# EAGLE board M869D (EAGLE 6.6.0)
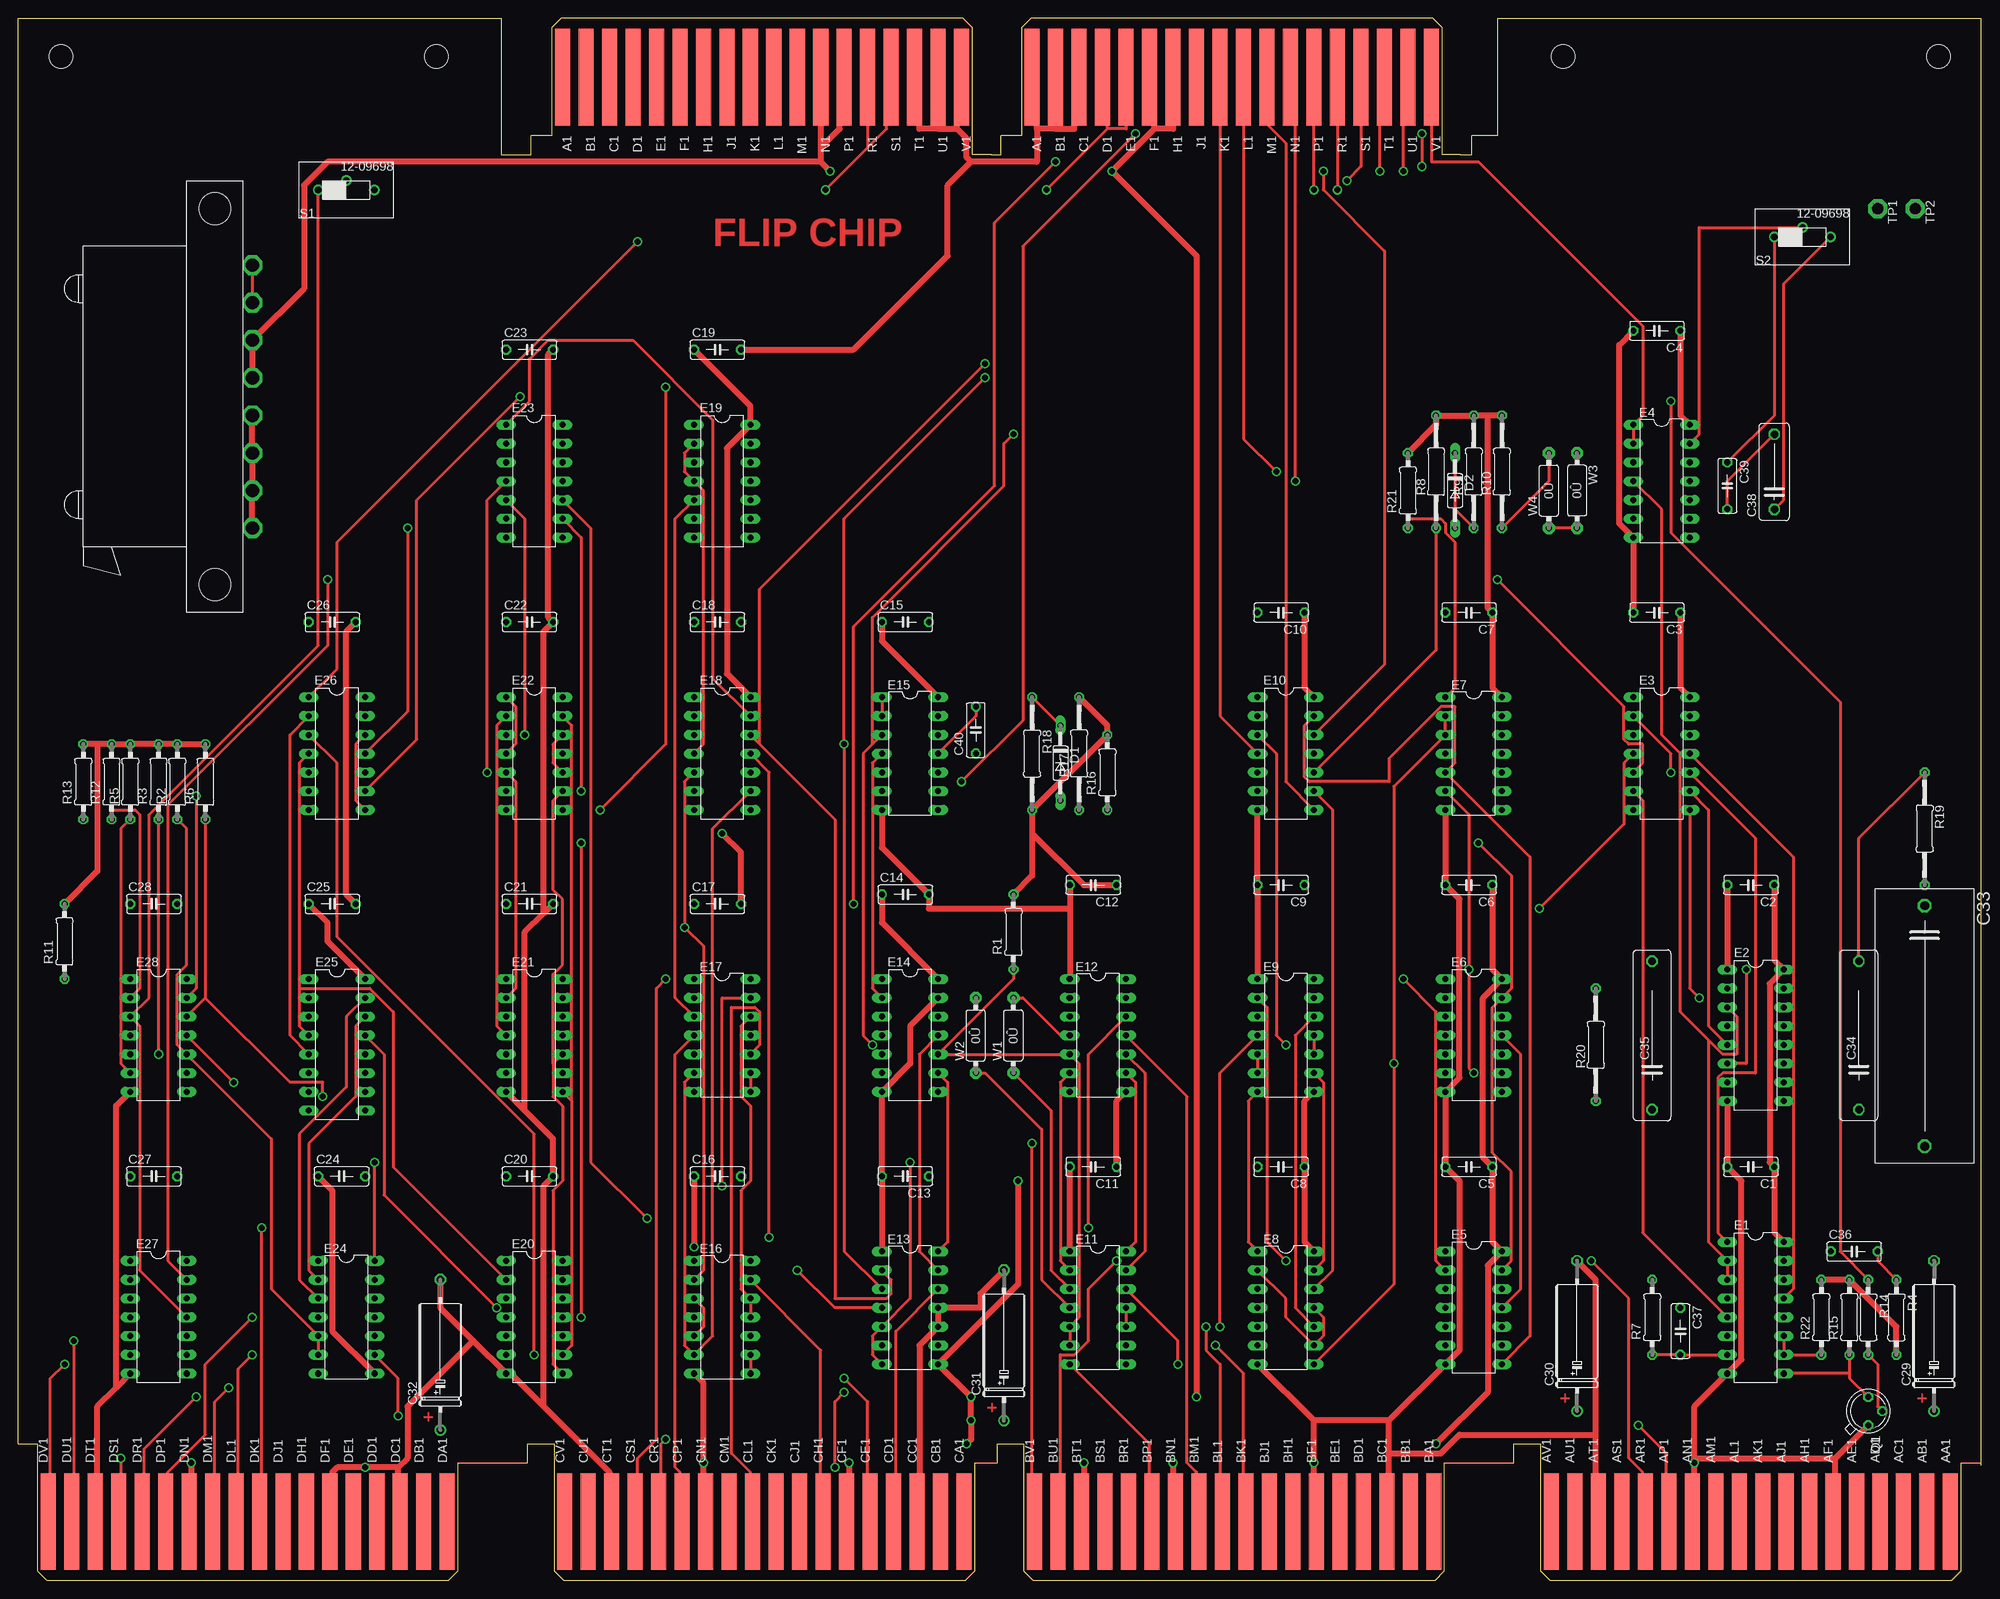
[diagram p2: board, top side]
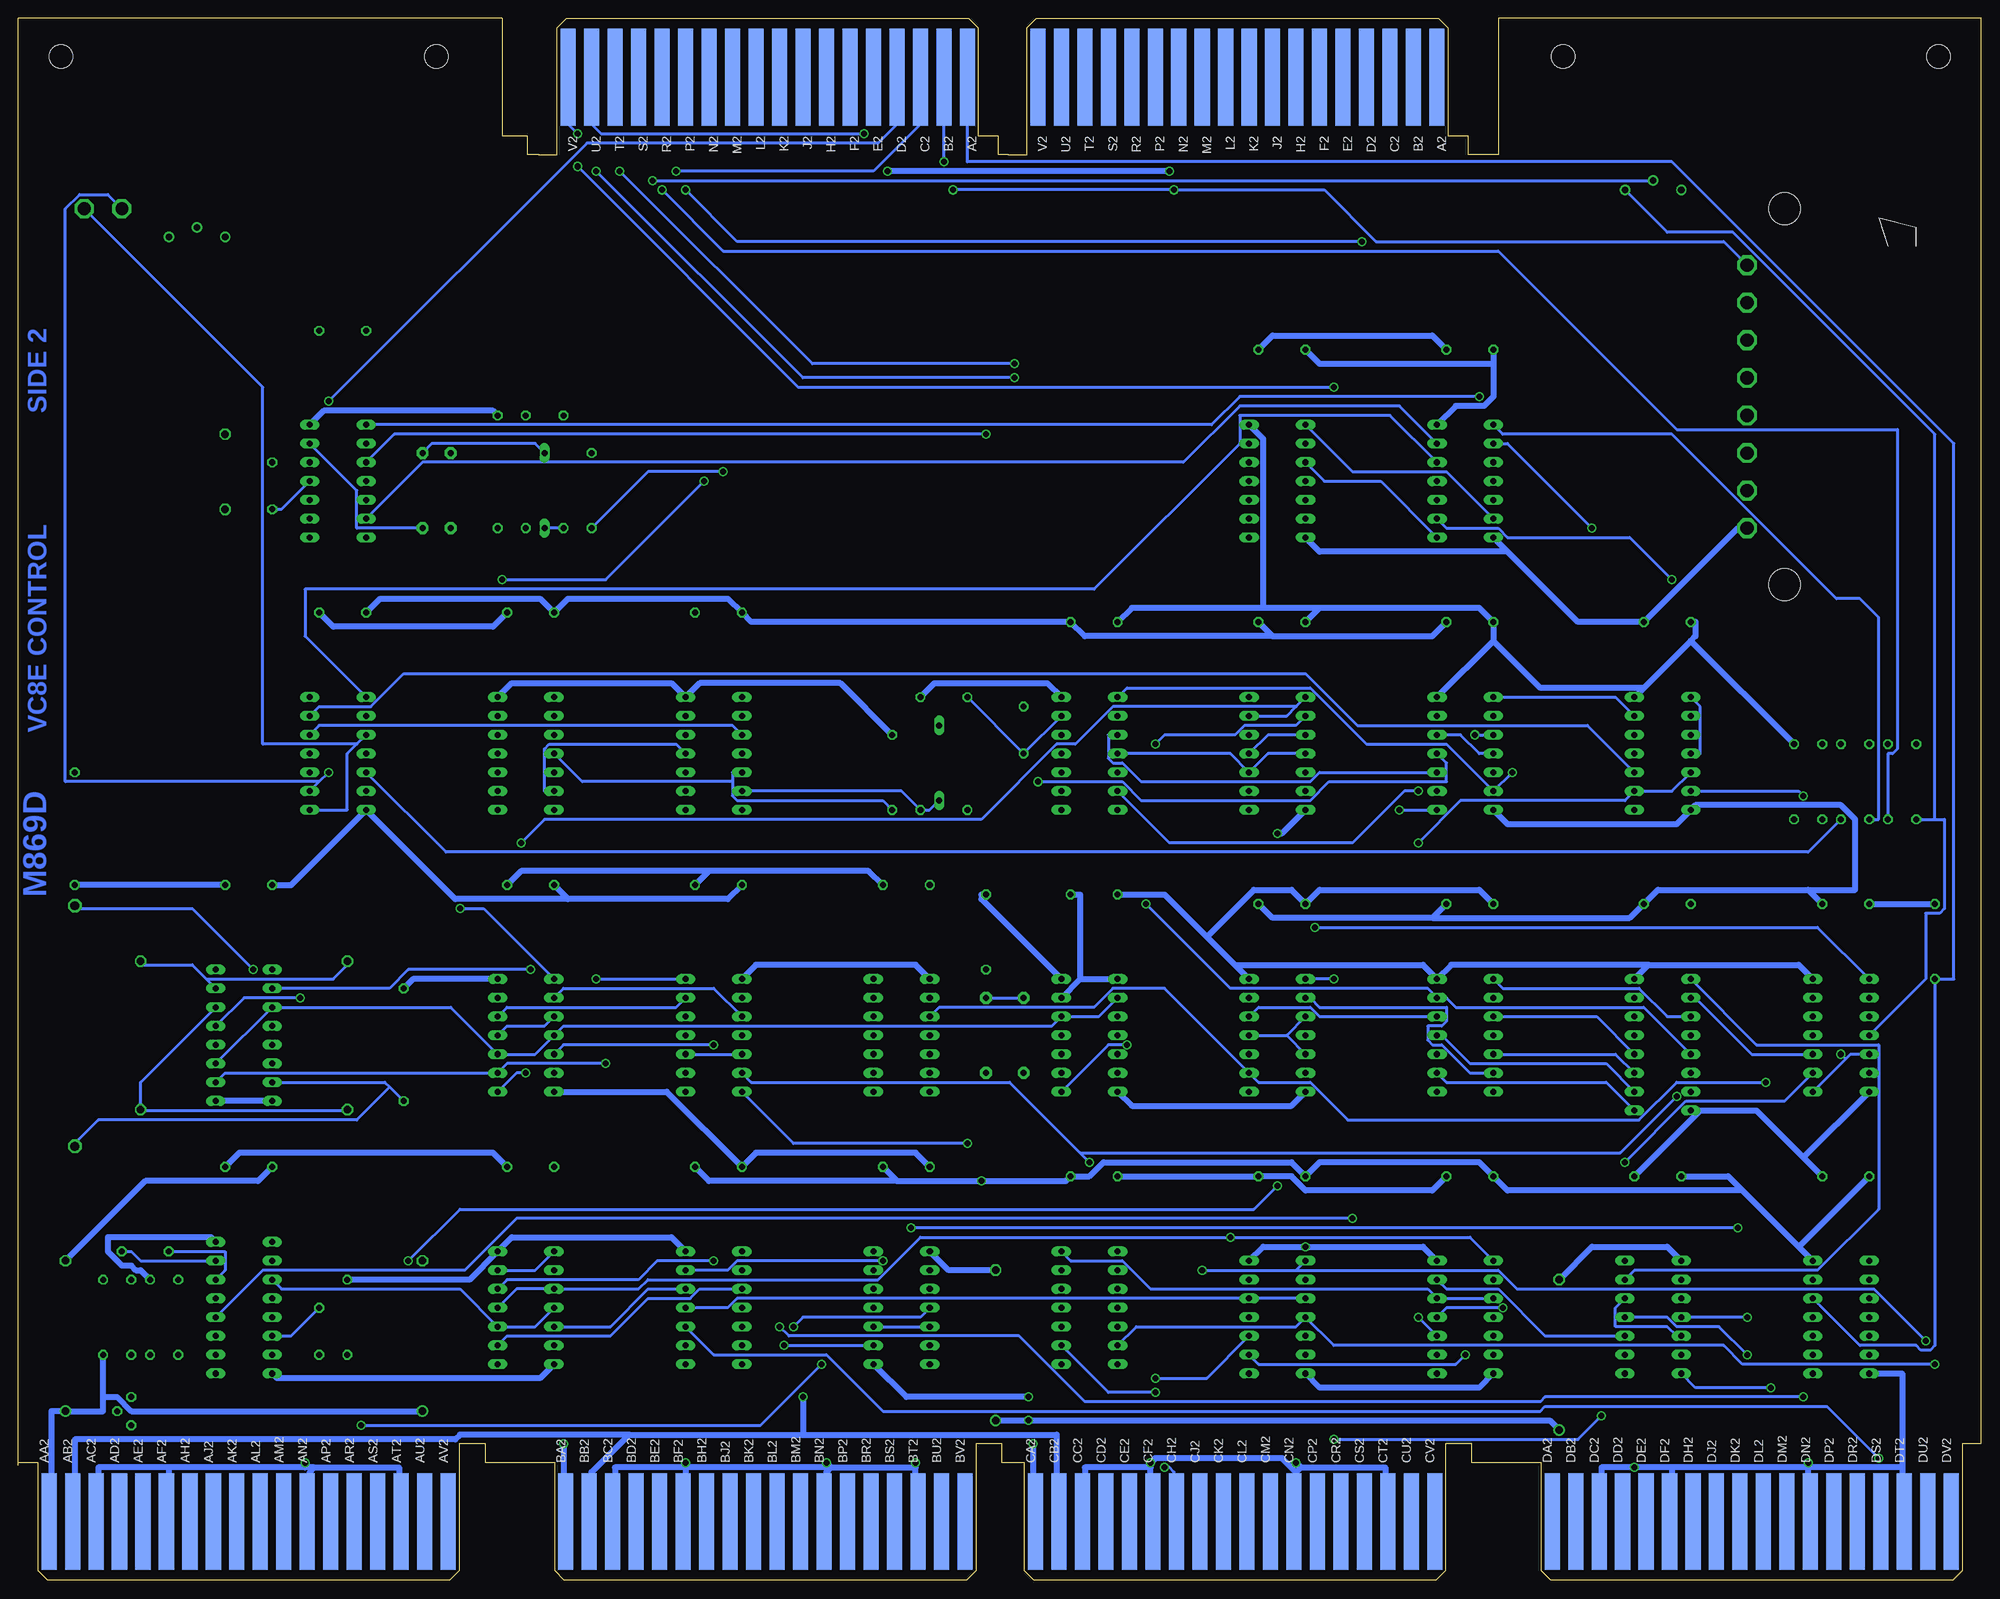
[diagram p3: board, bottom side, seen from below]

Size 265.3 x 211.14 mm. Coordinates in mm from the lower left corner, seen from the top.
Outline: 131.44,192.72 132.8,192.72 132.8,195.26 133.38,195.26
Outline: 265.3,15.56 265.3,211.14 199.9,211.14 199.9,195.26 196.47,195.26 196.47,192.72 194.94,192.72
Outline: 68.6,192.72 65.28,192.72 65.28,211.14 0,211.14 0,18.41
Outline: 69.88,195.26 69.3,195.26 69.3,192.72 68.45,192.72
Copper layers (1+2+15+16): Top 0.035mm / dielectric 1.5mm / ECO1 0.035mm / dielectric 0.15mm / ECO2 0.035mm / dielectric 0.2mm / Bottom 0.035mm
Design rules "16mils *": minimum track width 16mil, minimum drill 32mil, track to track 15mil, track to pad 10mil, pad to pad 10mil, via to via 10mil, smd to smd 10mil, copper to edge 13mil, drill to drill 10mil, minimum pad ring 10mil, minimum via ring 8mil, stop-mask expansion 0mil, vias tented up to drill 0mil, thermal gap 10mil
Net classes: 1 supply: width 0.813 mm
Holes 3.2 mm at 56.52,205.99 5.71,205.99 208.79,205.99 259.59,205.99

## Footprints (pad centres in the part's own frame; a part is rotated, then mirrored left to right if it is on the bottom)
C063-025X075 = drill 0.813 octagon: 1 -2.54,0; 2 3.81,0
E12-8 = drill 1.016: + -10.16,0 | drill 1.016 octagon: - 10.16,0
C325-137X374 = drill 1.194 octagon: 1 -16.256,0; 2 16.256,0
C203-054-229 = drill 1.016 octagon: 1 -10.033,0; 2 10.033,0
C102-043X133 = drill 1.016 octagon: 1 -5.08,0; 2 5.08,0
DO35-10 = drill 0.813 long: A 5.08,0; C -5.08,0
DIL16 = drill 0.813 long: 1 -8.89,-3.81; 2 -6.35,-3.81; 3 -3.81,-3.81; 4 -1.27,-3.81; 5 1.27,-3.81; 6 3.81,-3.81; 7 6.35,-3.81; 8 8.89,-3.81; 9 8.89,3.81; 10 6.35,3.81; 11 3.81,3.81; 12 1.27,3.81; 13 -1.27,3.81; 14 -3.81,3.81; 15 -6.35,3.81; 16 -8.89,3.81
DIL14 = drill 0.813 long: 1 -7.62,-3.81; 2 -5.08,-3.81; 3 -2.54,-3.81; 4 0,-3.81; 5 2.54,-3.81; 6 5.08,-3.81; 7 7.62,-3.81; 8 7.62,3.81; 9 5.08,3.81; 10 2.54,3.81; 11 0,3.81; 12 -2.54,3.81; 13 -5.08,3.81; 14 -7.62,3.81
EDGE-CON2 = smd 13.106 x 2.032: A1 7.938,4.128; B1 7.938,7.303; C1 7.938,10.477; D1 7.938,13.652; E1 7.938,16.828; F1 7.938,20.003; H1 7.938,23.177; J1 7.938,26.352; K1 7.938,29.527; L1 7.938,32.703; M1 7.938,35.877; N1 7.938,39.053; P1 7.938,42.227; R1 7.938,45.403; S1 7.938,48.578; T1 7.938,51.752; U1 7.938,54.928; V1 7.938,58.102 | smd 13.106 x 2.032 bottom: A2 7.938,4.128; B2 7.938,7.303; C2 7.938,10.477; D2 7.938,13.652; E2 7.938,16.828; F2 7.938,20.003; H2 7.938,23.177; J2 7.938,26.352; K2 7.938,29.527; L2 7.938,32.703; M2 7.938,35.877; N2 7.938,39.053; P2 7.938,42.227; R2 7.938,45.403; S2 7.938,48.578; T2 7.938,51.752; U2 7.938,54.928; V2 7.938,58.102
1-480459-0 = drill 1.778 octagon: 1 46.99,-1.27; 2 41.91,-1.27; 3 36.83,-1.27; 4 31.75,-1.27; 5 26.67,-1.27; 6 21.59,-1.27; 7 16.51,-1.27; 8 11.43,-1.27 | hole 4.318: 3.81,3.81; 54.61,3.81
EDGE-CON8 = smd 2.032 x 13.106: AA1 261.303,7.938; AB1 258.127,7.938; AC1 254.952,7.938; AD1 251.778,7.938; AE1 248.602,7.938; AF1 245.428,7.938; AH1 242.252,7.938; AJ1 239.077,7.938; AK1 235.903,7.938; AL1 232.727,7.938; AM1 229.553,7.938; AN1 226.377,7.938; AP1 223.202,7.938; AR1 220.028,7.938; AS1 216.852,7.938; AT1 213.678,7.938; AU1 210.502,7.938; AV1 207.327,7.938; BA1 191.452,7.938; BB1 188.278,7.938; BC1 185.102,7.938; BD1 181.928,7.938; BE1 178.752,7.938; BF1 175.577,7.938; BH1 172.403,7.938; BJ1 169.227,7.938; BK1 166.053,7.938; BL1 162.877,7.938; BM1 159.702,7.938; BN1 156.528,7.938; BP1 153.352,7.938; BR1 150.178,7.938; BS1 147.002,7.938; BT1 143.827,7.938; BU1 140.653,7.938; BV1 137.477,7.938; CA1 127.953,7.938; CB1 124.778,7.938; CC1 121.603,7.938; CD1 118.427,7.938; CE1 115.252,7.938; CF1 112.078,7.938; CH1 108.903,7.938; CJ1 105.728,7.938; CK1 102.552,7.938; CL1 99.377,7.938; CM1 96.203,7.938; CN1 93.028,7.938; CP1 89.853,7.938; CR1 86.677,7.938; CS1 83.502,7.938; CT1 80.328,7.938; CU1 77.153,7.938; CV1 73.978,7.938; DA1 58.102,7.938; DB1 54.928,7.938; DC1 51.752,7.938; DD1 48.578,7.938; DE1 45.403,7.938; DF1 42.227,7.938; DH1 39.053,7.938; DJ1 35.877,7.938; DK1 32.703,7.938; DL1 29.527,7.938; DM1 26.352,7.938; DN1 23.177,7.938; DP1 20.003,7.938; DR1 16.828,7.938; DS1 13.652,7.938; DT1 10.477,7.938; DU1 7.303,7.938; DV1 4.128,7.938 | smd 2.032 x 13.106 bottom: AA2 261.303,7.938; AB2 258.127,7.938; AC2 254.952,7.938; AD2 251.778,7.938; AE2 248.602,7.938; AF2 245.428,7.938; AH2 242.252,7.938; AJ2 239.077,7.938; AK2 235.903,7.938; AL2 232.727,7.938; AM2 229.553,7.938; AN2 226.377,7.938; AP2 223.202,7.938; AR2 220.028,7.938; AS2 216.852,7.938; AT2 213.678,7.938; AU2 210.502,7.938; AV2 207.327,7.938; BA2 191.452,7.938; BB2 188.278,7.938; BC2 185.102,7.938; BD2 181.928,7.938; BE2 178.752,7.938; BF2 175.577,7.938; BH2 172.403,7.938; BJ2 169.227,7.938; BK2 166.053,7.938; BL2 162.877,7.938; BM2 159.702,7.938; BN2 156.528,7.938; BP2 153.352,7.938; BR2 150.178,7.938; BS2 147.002,7.938; BT2 143.827,7.938; BU2 140.653,7.938; BV2 137.477,7.938; CA2 127.953,7.938; CB2 124.778,7.938; CC2 121.603,7.938; CD2 118.427,7.938; CE2 115.252,7.938; CF2 112.078,7.938; CH2 108.903,7.938; CJ2 105.728,7.938; CK2 102.552,7.938; CL2 99.377,7.938; CM2 96.203,7.938; CN2 93.028,7.938; CP2 89.853,7.938; CR2 86.677,7.938; CS2 83.502,7.938; CT2 80.328,7.938; CU2 77.153,7.938; CV2 73.978,7.938; DA2 58.102,7.938; DB2 54.928,7.938; DC2 51.752,7.938; DD2 48.578,7.938; DE2 45.403,7.938; DF2 42.227,7.938; DH2 39.053,7.938; DJ2 35.877,7.938; DK2 32.703,7.938; DL2 29.527,7.938; DM2 26.352,7.938; DN2 23.177,7.938; DP2 20.003,7.938; DR2 16.828,7.938; DS2 13.652,7.938; DT2 10.477,7.938; DU2 7.303,7.938; DV2 4.128,7.938
TO18- = drill 0.813 octagon: 1 1.905,0; 2 0,1.905; 3 -1.905,0
0207/10 = drill 0.813 octagon: 1 -5.08,0; 2 5.08,0
0207/15 = drill 0.813 octagon: 1 -7.62,0; 2 7.62,0
23-021 = drill 0.9: 1 -3.81,0; 2 0,1.27; 3 3.81,0
P1-17 = drill 1.702 pad 2.54 octagon: TP 0,0
0R/10 = drill 0.813 pad 1.6 octagon: 1 -5.08,0; 2 5.08,0

## Placement (x,y rotation side)
C1  .01uF  [C063-025X075]  234.82,55.88 180 top
C2  .01uF  [C063-025X075]  234.82,93.98 180 top
C3  .01uF  [C063-025X075]  222.12,130.81 180 top
C4  .01uF  [C063-025X075]  222.12,168.91 180 top
C5  .01uF  [C063-025X075]  196.72,55.88 180 top
C6  .01uF  [C063-025X075]  196.72,93.98 180 top
C7  .01uF  [C063-025X075]  196.72,130.81 180 top
C8  .01uF  [C063-025X075]  171.32,55.88 180 top
C9  .01uF  [C063-025X075]  171.32,93.98 180 top
C10  .01uF  [C063-025X075]  171.32,130.81 180 top
C11  .01uF  [C063-025X075]  145.92,55.88 180 top
C12  .01uF  [C063-025X075]  145.92,93.98 180 top
C13  .01uF  [C063-025X075]  120.52,54.61 180 top
C14  .01uF  [C063-025X075]  119.25,92.71 0 top
C15  .01uF  [C063-025X075]  119.25,129.54 0 top
C16  .01uF  [C063-025X075]  93.85,54.61 0 top
C17  .01uF  [C063-025X075]  93.85,91.44 0 top
C18  .01uF  [C063-025X075]  93.85,129.54 0 top
C19  .01uF  [C063-025X075]  93.85,166.37 0 top
C20  .01uF  [C063-025X075]  68.45,54.61 0 top
C21  .01uF  [C063-025X075]  68.45,91.44 0 top
C22  .01uF  [C063-025X075]  68.45,129.54 0 top
C23  .01uF  [C063-025X075]  68.45,166.37 0 top
C24  .01uF  [C063-025X075]  43.05,54.61 0 top
C25  .01uF  [C063-025X075]  41.78,91.44 0 top
C26  .01uF  [C063-025X075]  41.78,129.54 0 top
C27  .01uF  [C063-025X075]  17.65,54.61 0 top
C28  .01uF  [C063-025X075]  17.65,91.44 0 top
C29  6.8uF  [E12-8]  258.95,33.02 90 top
C30  6.8uF  [E12-8]  210.69,33.02 90 top
C31  6.8uF  [E12-8]  133.22,31.75 90 top
C32  6.8uF  [E12-8]  57.02,30.48 90 top
C33  .033uF  [C325-137X374]  257.68,74.93 270 top
C34  .022uF  [C203-054-229]  248.79,73.66 90 top
C35  .22uF  [C203-054-229]  220.85,73.66 90 top
C36  220pF  [C063-025X075]  247.52,44.45 0 top
C37  220pF  [C063-025X075]  224.66,34.29 270 top
C38  2700pF  [C102-043X133]  237.36,149.86 90 top
C39  .01uf 10%  [C063-025X075]  231.01,148.59 270 top
C40  470pF  [C063-025X075]  129.41,114.3 90 top
D1  D664  [DO35-10]  140.84,110.49 270 top
D2  D664  [DO35-10]  194.18,147.32 270 top
E1  74123N  [DIL16]  234.82,36.83 270 top
E2  74123N  [DIL16]  234.82,73.66 270 top
E3  7402N  [DIL14]  222.12,111.76 270 top
E4  9601  [DIL14]  222.12,148.59 270 top
E5  7474N  [DIL14]  196.72,36.83 270 top
E6  7474N  [DIL14]  196.72,73.66 270 top
E7  N8881N  [DIL14]  196.72,111.76 270 top
E8  N8881N  [DIL14]  171.32,36.83 270 top
E9  SP380N  [DIL14]  171.32,73.66 270 top
E10  7406N  [DIL14]  171.32,111.76 270 top
E11  SP380N  [DIL14]  145.92,36.83 270 top
E12  SP314N  [DIL14]  145.92,73.66 270 top
E13  SP380N  [DIL14]  120.52,36.83 270 top
E14  7404N  [DIL14]  120.52,73.66 270 top
E15  9601  [DIL14]  120.52,111.76 270 top
E16  N8881N  [DIL14]  95.12,35.56 270 top
E17  N8881N  [DIL14]  95.12,73.66 270 top
E18  7474N  [DIL14]  95.12,111.76 270 top
E19  7474N  [DIL14]  95.12,148.59 270 top
E20  7402N  [DIL14]  69.72,35.56 270 top
E21  7404N  [DIL14]  69.72,73.66 270 top
E22  7400N  [DIL14]  69.72,111.76 270 top
E23  74H21N  [DIL14]  69.72,148.59 270 top
E24  SP380N  [DIL14]  44.32,35.56 270 top
E25  DEC8251  [DIL16]  43.05,72.39 270 top
E26  7400N  [DIL14]  43.05,111.76 270 top
E27  7400N  [DIL14]  18.92,35.56 270 top
E28  7416N  [DIL14]  18.92,73.66 270 top
F  EDGE-TOP  [EDGE-CON2]  132.91,211.14 270 top
H  EDGE-TOP  [EDGE-CON2]  69.41,211.14 270 top
J1  1-480459-0  [1-480459-0]  30.35,130.81 90 top
OMNIBUS  QUAD  [EDGE-CON8]  -0.13,0 0 top
Q1  2N3009  [TO18-]  250.06,22.86 270 top
R1  1.5K  [0207/10]  134.49,87.63 90 top
R2  470  [0207/10]  21.46,107.95 90 top
R3  470  [0207/10]  18.92,107.95 90 top
R4  10K  [0207/10]  253.87,35.56 270 top
R5  470  [0207/10]  15.11,107.95 90 top
R6  470  [0207/10]  25.27,107.95 90 top
R7  10K  [0207/10]  220.85,35.56 90 top
R8  19.6K 1%  [0207/15]  191.64,149.86 90 top
R9  6.81K 1%  [0207/15]  196.72,149.86 90 top
R10  33.2K 1%  [0207/15]  200.53,149.86 90 top
R11  1.5K  [0207/10]  6.22,86.36 90 top
R12  470  [0207/10]  12.57,107.95 90 top
R13  470  [0207/10]  8.76,107.95 90 top
R14  1K  [0207/10]  250.06,35.56 270 top
R15  1K  [0207/10]  247.52,35.56 90 top
R16  1K  [0207/10]  147.19,109.22 90 top
R17  12.1K 1%  [0207/15]  143.38,111.76 90 top
R18  39.2K 1%  [0207/15]  137.03,111.76 270 top
R19  24.3K 1%  [0207/15]  257.68,101.6 270 top
R20  31.6K 1%  [0207/15]  213.23,72.39 90 top
R21  470  [0207/10]  187.83,147.32 90 top
R22  1K  [0207/10]  243.71,35.56 90 top
S1  12-09698  [23-021]  44.32,187.96 0 top
S2  12-09698  [23-021]  241.17,181.61 0 top
TP1  TPSQPAD1-17  [P1-17]  251.33,185.42 270 top
TP2  TPSQPAD1-17  [P1-17]  256.41,185.42 270 top
W1  0  [0R/10]  134.49,73.66 90 top
W2  open  [0R/10]  129.41,73.66 90 top
W3  0  [0R/10]  210.69,147.32 270 top
W4  open  [0R/10]  206.88,147.32 90 top

## Tracks (layer width: path | path; a pad name or v marks a point on that pad's centre or on a via)
!B_DICD  (via drill 0.81)
  Top 0.406: v68.45,114.3 68.45,143.51 E23.5
  Bottom 0.406: v68.45,114.3 E22.3
!B_DIXY  (via drill 0.81)
  Top 0.406: E15.1 E15.2 | E23.4 63.37,146.05 v63.37,109.22
  Bottom 0.406: E15.1 115.44,120.65 90.68,120.65 83.06,113.03 72.26,113.03 E22.6 v63.37,109.22
!B_LOAD_EN  (via drill 0.81)
  Top 0.406: E26.11 52.58,117.47 v52.58,142.24
  Bottom 0.406: v52.58,142.24 64.01,153.67 E23.2
!BTP3
  Top 0.406: E13.14 125.6,45.72 125.6,67.31 E14.9
  Bottom 0.406: E20.3 E20.12 74.8,39.37 112.27,39.37 116.08,43.18 123.06,43.18 E13.14
!C0  (via drill 0.81)
  Top 0.406: v111.63,27.3 114.81,24.13 114.81,8.26 OMNIBUS.CE1
  Bottom 0.406: E16.10 104.65,27.3 v111.63,27.3
!C1
  Top 0.406: E16.13 108.46,31.11 108.46,8.26 OMNIBUS.CH1
!CHAN  (via drill 0.81)
  Top 0.406: E28.2 16.38,80.01 16.38,103.5 15.75,104.14 12.57,104.14 R12.1 | F.R1 v178.31,187.96
  Bottom 0.406: R12.1 12.57,111.76 11.94,111.76 11.3,112.39 11.3,155.57 41.15,155.57 65.28,179.71 170.05,179.71 v178.31,187.96
!CL_DONE
  Bottom 0.406: E23.6 72.26,149.86 84.96,149.86 E19.1
!CLEAR  (via drill 0.81)
  Top 0.406: E5.13 201.8,43.18 201.8,55.24 199.26,57.78 199.26,77.47 E6.13 201.8,80.01 201.8,95.25 v197.36,99.69 | E28.6 13.84,69.85 13.84,101.6 R5.1 | E18.13 93.85,121.92 93.85,156.84 83.06,167.64 71.63,167.64 69.09,165.1 69.09,159.38 E23.1
  Bottom 0.406: E5.1 195.45,41.91 E5.13 | 92.58,118.11 93.85,116.84 E18.13 | 92.58,118.11 E18.1 | E23.1 64.64,154.94 41.78,154.94 19.56,132.72 16.38,132.72 13.84,130.18 13.84,102.87 R5.1 | v197.36,99.69 194.18,102.87 135.13,102.87 124.97,113.03 122.43,113.03 117.35,118.11 92.58,118.11
!CLEAR_DONE
  Bottom 0.406: E26.10 53.21,115.57 84.33,115.57 91.31,122.56 213.23,122.56 217.68,118.11 224.66,118.11 E3.13
!COL_RED  (via drill 0.81)
  Top 0.406: E7.1 194.18,120.65 194.18,140.34 192.91,141.6 192.91,142.88 192.28,143.51 187.83,143.51 R21.1 | v170.05,149.86 165.61,154.31 F.L1
  Bottom 0.406: R21.1 180.21,149.86 v170.05,149.86
!COLOR  (via drill 0.81)
  Top 0.406: v196.72,68.58 196.09,69.22 v196.09,82.55 196.09,103.5 E7.6
  Bottom 0.406: E6.8 197.99,68.58 v196.72,68.58 | E10.11 176.4,113.03 193.55,113.03 194.18,112.39 194.18,106.68 E7.6 | E2.2 215.14,80.01 212.6,82.55 v196.09,82.55
!DATA00  (via drill 0.81)
  Top 0.406: E17.13 95.12,78.74 v95.12,53.34 | v212.6,43.18 217.68,38.1 217.68,16.51 219.58,14.61 219.58,8.26 OMNIBUS.AR1
  Bottom 0.406: v95.12,53.34 98.3,50.16 205.61,50.16 v212.6,43.18
!DATA06  (via drill 0.81)
  Top 0.406: E8.13 176.4,43.18 176.4,67.31 E9.9 | v148.46,43.18 144.65,39.37 144.65,32.38 142.75,30.48 140.84,30.48 140.84,8.26 OMNIBUS.BU1
  Bottom 0.406: E8.13 169.42,41.91 168.15,43.18 v148.46,43.18
!DATA07  (via drill 0.81)
  Top 0.406: E8.1 166.24,45.72 166.24,64.77 E9.7 | v137.03,59.05 137.03,8.26 OMNIBUS.BV1
  Bottom 0.406: E9.7 160.53,59.05 v137.03,59.05
!DATA08  (via drill 0.81)
  Top 0.406: E9.4 162.43,68.58 v162.43,34.29 | v24,24.77 17.02,17.78 17.02,8.26 OMNIBUS.DR1
  Bottom 0.406: v162.43,34.29 161.16,33.02 130.05,33.02 121.16,24.13 59.56,24.13 58.93,24.77 v24,24.77
!DATA09  (via drill 0.81)
  Top 0.406: E8.10 172.59,36.83 172.59,73.66 E9.12 | v13.84,16.51 13.84,8.26 OMNIBUS.DS1
  Bottom 0.406: v13.84,16.51 20.83,23.5 58.93,23.5 59.56,22.86 148.46,22.86 156.08,30.48 171.32,30.48 E8.10
!DATA10  (via drill 0.81)
  Top 0.406: v105.28,41.91 110.36,36.83 E13.4 | v7.49,32.38 7.49,8.26 OMNIBUS.DU1
  Bottom 0.406: 92.58,41.91 E16.1 | v105.28,41.91 92.58,41.91 | v7.49,32.38 14.48,39.37 62.74,39.37 65.28,41.91 92.58,41.91
!DATA11  (via drill 0.81)
  Top 0.406: v6.22,29.21 4.32,27.3 4.32,8.26 OMNIBUS.DV1
  Bottom 0.406: E13.6 114.17,34.29 92.58,34.29 E16.4 87.5,31.75 34.8,31.75 32.26,29.21 v6.22,29.21
!DEL_1  (via drill 0.81)
  Top 0.406: E27.13 20.19,43.18 20.19,104.78 41.78,126.36 v41.78,135.25 | v76.07,106.68 76.07,140.97 E23.9
  Bottom 0.406: v41.78,135.25 47.5,140.97 64.01,140.97 65.28,142.24 72.26,142.24 E23.9 | E15.6 109.73,99.69 84.96,99.69 77.98,106.68 v76.07,106.68
!DICD
  Bottom 0.406: E25.12 51.94,76.2 E21.3
!DICL  (via drill 0.81)
  Top 0.406: v64.64,36.83 49.4,52.07 49.4,71.12 E25.13
  Bottom 0.406: E20.11 72.26,36.83 v64.64,36.83
!DILE  (via drill 0.81)
  Top 0.406: E25.4 37.97,74.93 37.97,80.01 | 37.97,80.01 37.97,110.49 E26.4 | E20.2 50.67,55.88 50.67,76.83 47.5,80.01 37.97,80.01 | v175.13,187.96 F.P1 | v83.69,180.97 43.05,140.34 43.05,123.19 E26.1
  Bottom 0.406: E26.1 37.97,118.11 37.97,111.76 E26.4 | v175.13,187.96 168.15,180.97 v83.69,180.97
!DILX
  Bottom 0.406: E25.10 50.67,69.85 69.09,69.85 72.9,73.66 E21.11
!DILY
  Bottom 0.406: E25.9 50.67,67.31 72.26,67.31 E21.9
!DIRE  (via drill 0.81)
  Top 0.406: E26.2 36.7,114.3 36.7,73.66 E25.5 | v140.21,191.77 131.95,183.51 131.95,147.96 112.9,128.91 v112.9,91.44
  Bottom 0.406: E25.5 45.59,77.47 70.99,77.47 72.26,78.74 E21.13 74.8,80.01 101.47,80.01 v112.9,91.44 | v140.21,191.77 F.B2
!DISD
  Bottom 0.406: E25.11 49.4,71.12 E21.5
!DIXY
  Bottom 0.406: E25.3 42.42,76.2 46.23,80.01 64.64,80.01 E21.1
!DLY_DONE
  Bottom 0.406: E3.1 226.57,127.64 226.57,133.99 119.89,133.99 100.2,153.67 100.2,157.48 79.88,157.48 E23.12
!ERASE
  Top 0.406: E10.4 162.43,116.84 F.K1
!ERASE_INTERVAL  (via drill 0.81)
  Top 0.406: R14.1 246.25,44.45 246.25,118.75 223.39,141.6 v223.39,159.38
  Bottom 0.406: v223.39,159.38 188.47,194.31 149.1,194.31 146.56,196.85 F.D2
!GREEN
  Bottom 0.406: D1.A 142.11,104.14 R17.1 145.92,106.68 E10.6
!INTERNAL_IO
  Top 0.406: E17.10 100.2,72.39 100.2,76.83 99.57,77.47 96.39,77.47 96.39,17.14 98.93,14.61 98.93,8.26 OMNIBUS.CL1
!INTERRUPT
  Top 0.406: E17.4 88.77,71.12 88.77,15.24 89.41,14.61 89.41,8.26 OMNIBUS.CP1
!IOT
  Top 0.406: E24.6 E24.5 34.16,39.37 34.16,59.69 E28.10 21.46,72.39 21.46,81.92 22.73,83.19 22.73,101.6 R2.1
  Bottom 0.406: E24.12 49.4,36.83 49.4,34.29 42.42,34.29 41.15,33.02 E24.5 | E28.10 30.99,71.12 38.61,78.74 E25.2
!LD_DEL
  Bottom 0.406: E4.6 210.69,151.13 107.82,151.13 100.2,158.75 78.61,158.75 E23.13
!LOAD_DATA  (via drill 0.81)
  Top 0.406: 25.27,78.74 E28.12 | R6.1 25.27,78.74 | E13.7 115.44,30.48 115.44,33.02 E13.5 120.52,38.1 v120.52,56.52 | E9.5 E9.6 | E9.11 E9.10 | 25.27,78.74 36.7,67.31 41.15,67.31 v41.15,65.41
  Bottom 0.406: E9.10 E9.5 | 121.79,57.78 131.32,67.31 166.24,67.31 E9.6 | 121.79,57.78 v120.52,56.52 | v41.15,65.41 48.77,57.78 121.79,57.78
!LOAD_EN  (via drill 0.81)
  Top 0.406: E4.2 E4.1 219.58,157.48 219.58,169.54 197.36,191.77 191.01,191.77 F.V1 | v76.07,99.69 v76.07,35.56 | v67.82,160.02 53.85,146.05 53.85,113.67 E26.9
  Bottom 0.406: v76.07,35.56 E20.10 | v76.07,99.69 70.36,105.41 48.13,105.41 E26.9 41.78,106.68 E26.5 | E4.1 104.01,156.21 100.2,160.02 v67.82,160.02
!MD3  (via drill 0.81)
  Top 0.406: E11.12 156.72,32.38 v156.72,29.21 | v218.95,20.95 222.76,17.14 222.76,8.26 OMNIBUS.AP1
  Bottom 0.406: v156.72,29.21 164.97,20.95 v218.95,20.95
!MD4  (via drill 0.81)
  Top 0.406: v161.8,31.75 165.61,27.94 165.61,8.26 OMNIBUS.BK1
  Bottom 0.406: v161.8,31.75 E11.9
!MD5  (via drill 0.81)
  Top 0.406: E11.4 138.3,40.64 138.3,60.96 130.68,68.58 W2.1 | v160.53,34.29 160.53,31.11 162.43,29.21 162.43,8.26 OMNIBUS.BL1
  Bottom 0.406: v160.53,34.29 159.26,35.56 143.38,35.56 E11.4
!MD6
  Top 0.406: E12.11 157.99,65.41 157.99,15.88 159.26,14.61 159.26,8.26 OMNIBUS.BM1
!MD7
  Top 0.406: E11.7 152.91,18.41 152.91,8.26 OMNIBUS.BP1
!MD8  (via drill 0.81)
  Top 0.406: E12.12 144.65,71.12 v144.65,47.62 | v32.89,47.62 32.89,8.26 OMNIBUS.DK1
  Bottom 0.406: v32.89,47.62 v144.65,47.62
!MD9  (via drill 0.81)
  Top 0.406: v31.62,30.48 29.72,28.57 29.72,8.26 OMNIBUS.DL1
  Bottom 0.406: E24.11 42.42,35.56 41.15,34.29 35.43,34.29 v31.62,30.48
!MD10  (via drill 0.81)
  Top 0.406: v28.45,26.04 26.54,24.13 26.54,8.26 OMNIBUS.DM1
  Bottom 0.406: E24.7 38.61,26.04 v28.45,26.04
!MD11  (via drill 0.81)
  Top 0.406: v31.62,35.56 25.27,29.21 25.27,19.68 20.19,14.61 20.19,8.26 OMNIBUS.DP1
  Bottom 0.406: v31.62,35.56 E24.4
!NON_STORE  (via drill 0.81)
  Top 0.406: E10.12 184.66,123.83 184.66,179.71 176.4,187.96 v176.4,190.5
  Bottom 0.406: v176.4,190.5 149.73,190.5 143.38,196.85 F.C2
!PAUSE
  Top 0.406: E13.12 118.62,33.66 118.62,8.26 OMNIBUS.CD1
!SET_DONE  (via drill 0.81)
  Top 0.406: v84.96,48.9 77.34,56.52 77.34,142.24 E23.10
  Bottom 0.406: E1.12 232.28,41.91 204.98,41.91 197.99,48.9 v84.96,48.9
!SKIP  (via drill 0.81)
  Top 0.406: v87.5,81.28 86.23,80.01 86.23,19.05 83.69,16.51 83.69,8.26 OMNIBUS.CS1
  Bottom 0.406: v87.5,81.28 E17.1
!STORE
  Top 0.406: E10.13 173.86,115.57 173.86,108.58 174.5,107.95 185.29,107.95 185.29,111.12 192.28,118.11 194.18,118.11 194.18,110.49 E7.5 204.34,97.79 204.34,33.02 E5.8
!WRITE_THRU
  Top 0.406: E10.8 171.32,107.95 171.32,194.31 168.78,196.85 F.M1
+3V
  Top 0.406: E19.2 90.04,152.4 90.04,149.86 E19.4 92.58,147.32 92.58,113.03 E18.4 | E14.2 115.44,80.01 115.44,110.49 E15.4 | E1.3 E1.2 228.47,45.72 228.47,73.03 | E4.4 222.12,144.78 222.12,114.3 224.66,111.76 224.66,76.83 228.47,73.03 | 228.47,73.03 230.38,71.12 232.28,71.12 232.28,76.2 E2.3
  Bottom 0.406: E14.2 119.25,76.2 E14.12 125.6,74.93 191.64,74.93 E6.4 195.45,71.12 E6.10 206.88,77.47 E2.3 E2.11 | E18.4 96.39,111.76 E18.10 101.47,111.76 E15.4 | E5.4 195.45,34.29 E5.10 205.61,39.37 229.74,39.37 E1.3
+15V  (via drill 0.81)
  Top 0.406: F.D1 147.19,202.56 147.19,196.22 | 147.19,196.22 149.73,196.22 F.E1 | J1.1 J1.2 | 114.81,193.68 v109.09,187.96 | H.R1 114.81,193.68 | H.S1 117.35,202.56 117.35,196.22 114.81,193.68 | v138.94,187.96 147.19,196.22
  Bottom 0.406: J1.1 34.8,180.97 81.79,180.97 88.77,187.96 v109.09,187.96 v138.94,187.96
-15V  (via drill 0.81)
  Top 0.813: F.F1 153.54,202.56 153.54,196.22 | 153.54,196.22 156.08,196.22 F.H1 | J1.4 J1.3 38.61,174.62 38.61,188.59 41.78,191.77 108.46,191.77 | H.N1 108.46,193.68 | 108.46,193.68 108.46,191.77 | H.P1 111,202.56 111,196.22 108.46,193.68 | 153.54,196.22 v147.83,190.5 159.26,179.07 v159.26,24.77 | 108.46,191.77 v109.73,190.5
  Bottom 0.813: 182.75,19.68 159.26,19.68 | 159.26,19.68 124.97,19.68 124.97,8.26 OMNIBUS.CB2 | 182.75,19.68 187.83,14.61 187.83,8.26 OMNIBUS.BB2 | 182.75,19.68 205.61,19.68 206.25,19.05 257.68,19.05 257.68,8.26 OMNIBUS.AB2 | v109.73,190.5 v147.83,190.5 | v159.26,24.77 159.26,19.68
BCOLOR
  Top 0.406: E10.10 191.64,125.73 R8.1
  Bottom 0.406: R8.1 D2.A
BIT10  (via drill 0.81)
  Top 0.406: E13.3 111.63,44.45 v111.63,113.03 111.63,143.51 v130.68,162.56 | F.U1 187.2,202.56 v187.2,190.5
  Bottom 0.406: v111.63,113.03 110.36,114.3 100.84,114.3 99.57,115.57 92.58,115.57 E18.2 | v187.2,190.5 159.26,162.56 v130.68,162.56
BIT11  (via drill 0.81)
  Top 0.406: E13.2 117.98,40.64 117.98,38.73 117.35,38.1 110.36,38.1 110.36,102.87 100.2,113.03 | E18.12 100.2,113.03 | F.T1 184.02,202.56 v184.02,190.5 | v130.68,164.47 100.2,133.99 100.2,113.03
  Bottom 0.406: v184.02,190.5 157.99,164.47 v130.68,164.47
BTP3  (via drill 0.81)
  Top 0.406: E22.10 72.26,110.49 72.26,113.03 E22.12 | E22.4 67.18,113.03 67.18,118.11 E22.1 | v115.44,72.39 114.17,73.66 114.17,111.76 115.44,113.03 | E15.3 115.44,113.03 | v134.49,154.94 133.22,153.67 133.22,147.96 115.44,130.18 115.44,113.03
  Bottom 0.406: E26.13 49.4,119.38 E22.1 | E22.12 70.36,114.3 67.82,111.76 E22.4 | E14.8 117.98,72.39 v115.44,72.39 | E4.3 214.5,154.94 v134.49,154.94 | E22.10 89.41,109.22 90.68,107.95 113.54,107.95 116.08,110.49 117.35,110.49 117.98,111.12 117.98,114.3 E15.3
CHAN  (via drill 0.81)
  Top 0.406: E18.5 90.04,107.95 v90.04,88.27 92.58,85.72 92.58,41.91 E16.2
  Bottom 0.406: E28.1 22.1,88.27 v90.04,88.27
CLEAR  (via drill 0.81)
  Top 0.406: v18.92,71.12 R3.1 | F.N1 172.59,202.56 v172.59,148.59 | v199.9,135.25 217.04,118.11 217.04,113.67 217.68,113.03 219.58,113.03 219.58,110.49 E3.5
  Bottom 0.406: 18.29,70.48 17.65,71.12 E28.5 | 18.29,70.48 E28.8 | 18.29,70.48 v18.92,71.12 | E3.5 207.52,98.42 23.37,98.42 R3.1 | v172.59,148.59 185.93,135.25 v199.9,135.25
COLOR  (via drill 0.81)
  Top 0.406: E8.8 185.93,40.01 v185.93,69.85 185.93,107.31 E7.3 E7.2
  Bottom 0.406: E2.10 237.36,68.58 E6.9 199.26,69.85 v185.93,69.85
DDONE
  Top 0.406: E1.13 239.9,39.37 239.9,97.79 E3.11
DEL_1
  Top 0.406: E27.11 16.38,41.91 16.38,74.93 E28.3 17.65,78.74 17.65,103.5 40.51,126.36 S1.1
DEL_1_L
  Bottom 0.406: E28.4 7.49,81.28 7.49,90.17 5.59,90.17 4.95,90.81 4.95,102.87 6.22,102.87 | R13.1 6.22,102.87 | S1.3 42.42,182.25 33.53,182.25 6.22,154.94 6.22,102.87
DICD
  Top 0.406: E21.4 64.64,74.93 64.64,115.57 E22.2
DILX
  Top 0.406: E20.8 72.26,29.21 72.26,52.7 73.53,53.98 73.53,64.14 72.26,65.41 72.26,69.85 | E21.10 72.26,69.85 | E22.9 72.26,105.41 72.26,93.34 73.53,92.08 73.53,83.19 72.26,81.92 72.26,69.85
DILY
  Top 0.406: E20.9 74.8,31.75 74.8,64.77 | E21.8 74.8,64.77 | E22.13 74.8,115.57 74.8,64.77
DIRE
  Top 0.406: E8.11 176.4,35.56 176.4,33.02 E8.9 171.32,35.56 171.32,38.1 E8.2 | E16.11 E16.12 97.66,39.37 97.66,52.7 98.93,53.98 98.93,64.14 97.66,65.41 97.66,74.93 E17.12 | E16.5 92.58,34.29 92.58,36.83 E16.3
  Bottom 0.406: E16.3 E16.12 168.15,38.1 169.42,36.83 E8.11 | E21.12 89.41,76.2 90.68,77.47 97.66,77.47 E17.12
DISD
  Bottom 0.406: E21.6 69.09,68.58 72.9,72.39 74.17,72.39 74.8,73.03 74.8,74.93 72.9,74.93 72.26,75.56 72.26,77.47 89.41,77.47 90.68,78.74 E17.2
DLY_DONE_L
  Top 0.406: E1.1 229.74,46.99 229.74,67.94 230.38,68.58 234.82,68.58 234.82,100.33 E3.10
ERASE  (via drill 0.81)
  Top 0.406: v171.32,72.39 170.05,73.66 170.05,111.76 E10.3
  Bottom 0.406: E6.5 191.64,72.39 v171.32,72.39 | E3.12 224.66,115.57 168.78,115.57 E10.3
GND  (via drill 0.81)
  Top 0.813: C2.2 E2.1 | E7.7 C6.2 194.82,92.08 194.82,67.94 E6.7 C5.2 194.82,53.98 194.82,31.11 E5.7 185.29,21.59 | E9.1 C9.2 E10.7 | E13.1 C13.2 E14.7 120.52,69.85 120.52,74.93 E14.13 | C12.2 142.11,90.81 | 142.11,90.81 E12.1 | E15.7 116.71,99.06 C14.2 123.06,90.81 142.11,90.81 | E2.8 C1.2 232.92,53.98 232.92,29.84 E1.8 226.57,23.5 226.57,16.51 | 245.62,16.51 Q1.1 | 245.62,16.51 245.62,8.26 OMNIBUS.AF2 | 226.57,16.51 v226.57,15.88 226.57,8.26 OMNIBUS.AN2 | 226.57,16.51 245.62,16.51 | v144.02,15.88 144.02,8.26 OMNIBUS.BT2 | v156.08,15.88 156.08,8.26 OMNIBUS.BN2 | C30.- 213.23,40.64 213.23,19.68 | 213.23,19.68 213.23,8.26 OMNIBUS.AT2 | 175.13,21.59 E8.7 | 175.13,21.59 v175.13,15.88 175.13,8.26 OMNIBUS.BF2 | 185.29,17.14 185.29,8.26 OMNIBUS.BC1 | 185.29,17.14 185.29,21.59 | 185.29,21.59 175.13,21.59 | E11.1 C11.2 | C31.- 130.05,38.73 130.05,36.83 E13.11 E13.10 121.79,31.75 121.79,8.26 OMNIBUS.CC1 | 213.23,19.68 194.82,19.68 192.28,17.14 185.29,17.14 | C3.2 E4.7 216.41,142.88 216.41,167 C4.2 | H.T1 121.79,202.56 121.79,196.22 124.33,196.22 | H.U1 124.33,196.22 | H.V1 126.87,202.56 126.87,196.22 | 124.33,196.22 126.87,196.22 | F.A1 137.67,202.56 137.67,196.22 | 140.21,196.22 137.67,196.22 | F.B1 140.21,196.22 | F.C1 142.75,202.56 142.75,196.22 140.21,196.22 | 126.87,196.22 128.14,194.94 128.14,192.41 128.78,191.77 | 128.78,191.77 137.67,191.77 137.67,196.22 | C23.2 71.63,165.74 71.63,130.18 C22.2 70.99,128.27 70.99,90.17 | 128.78,191.77 125.6,188.59 125.6,179.07 112.9,166.37 C19.2 | J1.5 J1.6 J1.7 J1.8 | 68.45,63.5 72.26,59.69 C20.2 70.99,53.34 70.99,23.5 | 68.45,63.5 E21.7 | 70.99,90.17 68.45,87.63 68.45,63.5
  Top 0.813: 70.99,90.17 C21.2 | v95.12,100.97 97.66,98.42 C17.2 | C26.2 44.32,128.27 44.32,92.71 C25.2 | v23.37,15.88 23.37,8.26 OMNIBUS.DN2 | 13.21,26.04 10.67,23.5 10.67,8.26 OMNIBUS.DT2 | 13.21,26.04 E27.7 | E28.7 13.21,64.14 13.21,26.04 | v112.27,15.88 112.27,8.26 OMNIBUS.CF1 | E16.7 92.58,26.67 v92.58,15.88 92.58,8.26 OMNIBUS.CN1 | 51.31,15.24 v46.86,15.24 43.05,15.24 42.42,14.61 42.42,8.26 OMNIBUS.DF2 | 51.31,15.24 51.31,8.26 OMNIBUS.DC1 | 61.47,32.38 57.02,36.83 C32.- | 61.47,32.38 E20.7 66.55,27.94 70.99,23.5 | 70.99,23.5 79.88,14.61 79.88,8.26 OMNIBUS.CT2 | 51.31,15.24 52.58,16.51 52.58,23.5 61.47,32.38
  Bottom 0.813: C2.2 228.47,93.98 E3.7 206.25,92.08 191.01,92.08 | 191.01,92.08 C6.2 | 191.01,92.08 169.42,92.08 C9.2 | E17.7 93.22,64.14 114.81,64.14 E14.7 | C13.2 C16.2 93.22,54.61 91.31,52.7 74.17,52.7 C20.2 | 121.79,81.28 E14.1 | E14.13 121.79,81.28 | 121.79,81.28 121.79,92.71 C14.2 | E9.1 165.61,83.19 144.02,83.19 E12.1 | 225.3,15.24 213.87,15.24 213.87,8.26 OMNIBUS.AT2 | 225.3,15.24 225.93,14.61 225.93,8.26 OMNIBUS.AN2 | 244.98,15.24 244.98,8.26 OMNIBUS.AF2 | 225.3,15.24 226.57,15.24 | 226.57,15.24 244.98,15.24 | 244.98,15.24 254.51,15.24 254.51,8.26 OMNIBUS.AC2 | E2.8 E2.9 | C29.- 248.16,53.98 232.92,53.98 C1.2 | v226.57,15.88 226.57,15.24 | 144.02,15.24 144.02,8.26 OMNIBUS.BT2 | 144.02,15.24 v144.02,15.88 | 155.45,15.24 144.02,15.24 | 155.45,15.24 156.08,14.61 156.08,8.26 OMNIBUS.BN2 | 155.45,15.24 v156.08,15.88 | 175.13,15.24 175.13,8.26 OMNIBUS.BF2 | 155.45,15.24 175.13,15.24 | 175.13,15.24 184.66,15.24 184.66,8.26 OMNIBUS.BC1 | E6.7 177.67,66.04 C8.2 165.61,57.78 144.02,57.78 C11.2 | E11.1 139.57,41.91 C31.- | v175.13,15.88 175.13,15.24 | E1.8 230.38,27.3 194.82,27.3 E5.7 | C3.2 216.41,132.72 194.82,132.72 C7.2 191.01,132.72 169.42,132.72 C10.2 166.24,129.54 C15.2 121.16,127.64 95.76,127.64 | C23.2 74.17,168.28 95.76,168.28 C19.2 | C22.2 74.17,127.64 95.76,127.64 | C18.2 95.76,127.64 | J1.8 32.89,142.24 C26.2 54.48,129.54 64.01,139.06 | 64.01,139.06 E23.7 | E19.7 89.41,139.06 64.01,139.06 | E22.7 64.01,102.23 41.15,102.23 E26.7 38.61,104.78 18.92,104.78 17.02,102.87 17.02,93.34 23.37,93.34 | 23.37,93.34 C28.2 | 23.37,93.34 43.69,93.34 C25.2 47.5,89.53 74.17,89.53 | C17.2 95.76,89.53 74.17,89.53 | C21.2 74.17,89.53
  Bottom 0.813: E18.7 94.49,100.97 v95.12,100.97 | 24,57.15 30.35,63.5 37.97,63.5 | 24,57.15 C27.2 | E25.8 37.97,63.5 | 24,57.15 E28.7 | 37.97,63.5 C24.2 | 23.37,15.24 23.37,8.26 OMNIBUS.DN2 | 23.37,15.24 v23.37,15.88 | 10.67,15.24 10.67,27.94 E27.7 | 10.67,15.24 10.67,8.26 OMNIBUS.DT2 | 10.67,15.24 23.37,15.24 | 41.78,15.24 41.78,8.26 OMNIBUS.DF2 | 23.37,15.24 41.78,15.24 | 41.78,15.24 v46.86,15.24 51.31,15.24 51.31,8.26 OMNIBUS.DC1 | 112.27,15.24 112.27,8.26 OMNIBUS.CF1 | 112.27,15.24 v112.27,15.88 111.63,16.51 94.49,16.51 92.58,14.61 | 91.95,15.24 80.52,15.24 80.52,8.26 OMNIBUS.CT2 | 92.58,14.61 91.95,15.24 | 92.58,14.61 92.58,8.26 OMNIBUS.CN1 | 112.27,15.24 121.16,15.24 121.16,8.26 OMNIBUS.CC1 | E24.1 42.42,45.09 52.58,45.09 C32.- | E16.7 89.41,26.04 67.82,26.04 E20.7 | v92.58,15.88 91.95,15.24
GRN_DELAY  (via drill 0.81)
  Top 0.406: v227.2,78.74 225.93,80.01 E3.8
  Bottom 0.406: E2.13 234.82,78.74 v227.2,78.74 | 219.58,113.03 220.85,111.76 220.85,104.14 E3.8 | 219.58,113.03 E3.3 | TP2.TP 232.28,161.29 232.28,113.03 219.58,113.03
INITIALIZE  (via drill 0.81)
  Top 0.406: E24.9 51.31,27.3 v51.31,22.23 | v87.5,19.05 86.87,18.41 86.87,8.26 OMNIBUS.CR1
  Bottom 0.406: v51.31,22.23 54.48,19.05 v87.5,19.05
INT_EN
  Top 0.406: E17.6 90.04,67.31 90.04,31.75 E16.6 93.85,33.02 93.85,101.6 E18.9
INTENS  (via drill 0.81)
  Top 0.406: v179.58,189.23 181.48,191.13 F.S1
  Bottom 0.406: v179.58,189.23 S1.2
IO3
  Top 0.406: E11.13 152.27,44.45 152.27,68.58 E12.10
IO4
  Top 0.406: E11.14 151,45.72 151,67.31 E12.9
IO5
  Top 0.406: E12.4 140.84,73.66 135.76,78.74 W1.2
  Bottom 0.406: W1.2 W2.2
IO7
  Top 0.406: E11.2 140.84,43.18 140.84,67.31 E12.6
IOT  (via drill 0.81)
  Top 0.406: E17.9 E17.8 | v29.08,67.31 E28.11
  Bottom 0.406: v29.08,67.31 41.15,67.31 46.23,62.23 85.6,62.23 90.68,67.31 97.66,67.31 E17.9 110.36,80.01 117.35,80.01 119.89,77.47 140.84,77.47 E12.3
LD_EN_REG  (via drill 0.81)
  Top 0.406: E18.11 101.47,109.22 v101.47,46.35 | E6.11 203.07,71.12 203.07,39.37 E5.11
  Bottom 0.406: E6.3 194.18,74.93 199.26,74.93 E6.11 | E18.11 96.39,114.3 E18.3 | E20.1 69.09,46.35 v101.47,46.35 143.38,46.35 149.1,40.64 180.21,40.64 181.48,39.37 E5.3 197.99,39.37 E5.11
LOAD_X  (via drill 0.81)
  Top 0.406: v78.61,104.14 87.5,113.03 v87.5,161.29 | v189.74,195.58 v189.74,191.13
  Bottom 0.406: v78.61,104.14 E22.8 | v87.5,161.29 159.89,161.29 v189.74,191.13 | v189.74,195.58 191.01,196.85 F.V2
LOAD_Y  (via drill 0.81)
  Top 0.406: v127.51,107.95 135.76,116.2 135.76,180.34 v151,195.58
  Bottom 0.406: E22.11 72.26,110.49 72.26,107.95 88.14,107.95 90.68,105.41 113.54,105.41 116.08,107.95 v127.51,107.95 | v151,195.58 186.56,195.58 187.83,196.85 F.U2
MD5
  Top 0.406: E11.3 139.57,41.91 139.57,63.5 W1.1
N$1
  Top 0.406: E19.5 88.77,143.51 88.77,78.74 E17.3
  Bottom 0.406: 93.85,73.66 E17.5 | E17.11 93.85,73.66 | 93.85,73.66 E17.3
N$2
  Top 0.406: E26.8 45.59,105.41 45.59,113.03 E26.12
N$3
  Bottom 0.406: E23.8 81.15,148.59 88.77,148.59 E19.3
N$4  (via drill 0.81)
  Top 0.406: E16.9 E16.8 | E26.3 43.05,110.49 43.05,87 69.72,60.33 v69.72,30.48
  Bottom 0.406: v69.72,30.48 70.99,29.21 97.66,29.21 E16.9
N$5  (via drill 0.81)
  Top 0.406: E28.13 24,80.01 v24,106.05
  Bottom 0.406: v24,106.05 24.64,106.68 E26.6
N$7
  Top 0.406: E21.2 67.18,80.01 67.18,107.95 E22.5
N$11
  Bottom 0.406: E9.13 176.4,77.47 199.26,77.47 E6.12
N$13  (via drill 0.81)
  Top 0.406: v187.2,81.28 191.64,76.83 191.64,43.18 E5.2
  Bottom 0.406: v187.2,81.28 E9.14
N$16
  Top 0.406: E13.13 121.79,44.45 121.79,71.12 E14.11
N$18  (via drill 0.81)
  Top 0.406: E24.14 v48.13,56.52
  Bottom 0.406: E28.9 26.54,64.77 39.88,64.77 v48.13,56.52
N$19
  Top 0.406: E24.3 37.97,40.64 37.97,60.33 44.32,66.67 44.32,76.2 E25.15
N$20
  Top 0.406: E24.2 39.24,41.91 39.24,59.05 45.59,65.41 45.59,74.93 E25.14
N$21
  Bottom 0.406: E24.13 46.86,41.91 22.1,41.91 13.84,50.16 13.84,72.39 30.35,72.39 E25.1
N$22  (via drill 0.81)
  Top 0.406: v171.32,43.18 168.78,45.72 168.78,77.47 E9.2
  Bottom 0.406: E5.12 199.26,40.64 181.48,40.64 178.94,43.18 v171.32,43.18
N$23
  Bottom 0.406: E24.10 58.93,33.02 65.28,39.37 72.26,39.37 E20.13
N$24
  Bottom 0.406: E9.3 171.32,80.01 191.64,80.01 E6.2
N$25
  Bottom 0.406: R16.1 148.46,105.41 168.15,105.41 168.78,106.05 168.78,107.95 | 168.78,107.95 168.78,109.22 E10.5 | E7.4 189.1,107.95 168.78,107.95
N$26  (via drill 0.81)
  Top 0.406: v205.61,90.81 217.04,102.23 217.04,110.49 E3.4
  Bottom 0.406: E6.1 202.44,90.81 v205.61,90.81
N$28
  Top 0.406: R18.1 D1.C
  Bottom 0.406: E15.13 C40.1 R18.1
N$29
  Top 0.406: E15.11 129.41,116.84 C40.2
N$30
  Top 0.406: R19.1 248.79,100.33 C34.2
  Bottom 0.406: 239.9,81.28 241.81,83.19 248.79,83.19 C34.2 | 239.9,81.28 E2.15 | 239.9,81.28 222.76,81.28 220.85,83.19 C35.2
N$31
  Bottom 0.406: 215.14,66.67 215.77,67.31 E2.7 | 215.14,66.67 R20.1 | 215.14,66.67 219.58,62.23 254.51,62.23 257.68,59.05 C33.2
N$32  (via drill 0.81)
  Top 0.406: E2.6 233.55,69.85 v233.55,82.55
  Bottom 0.406: v233.55,82.55 241.81,90.81 257.68,90.81 C33.1
N$33
  Bottom 0.406: E2.14 248.79,67.31 C34.1 248.79,63.5 220.85,63.5 C35.1
N$36
  Top 0.406: R4.1 251.33,43.18 C36.2
  Bottom 0.406: E1.15 248.79,43.18 250.06,44.45 C36.2
N$37
  Bottom 0.406: E1.14 237.36,41.91 237.36,44.45 C36.1
N$38
  Top 0.406: Q1.2 251.33,23.5 251.33,29.21 R14.2
N$39
  Top 0.406: 247.52,27.94 E1.9 | R15.1 247.52,27.94 | Q1.3 247.52,27.3 247.52,27.94
N$40
  Top 0.406: E1.11 E1.10 R22.1
N$41
  Top 0.406: R7.1 C37.2 E1.7
N$42
  Bottom 0.406: C37.1 228.47,33.02 E1.6
N$44
  Top 0.406: R9.1 194.18,144.78 D2.C
  Bottom 0.406: W3.1 209.42,153.67 195.45,153.67 D2.C
N$45
  Top 0.406: S2.2 227.2,182.88 227.2,154.94 E4.13 | W3.2 W4.1
  Bottom 0.406: E4.13 219.58,147.32 219.58,142.24 W3.2
N$46
  Top 0.406: R10.1 206.88,148.59 W4.2
N$47
  Top 0.406: C39.1 237.36,157.48 S2.1
N$48
  Top 0.406: S2.3 238.63,175.26 238.63,146.05 C38.1
N$49
  Top 0.406: C38.2 231.01,148.59 C39.2
  Bottom 0.406: E4.11 229.74,144.78 C39.2
PAUSE_L
  Top 0.406: E11.6 E11.5 143.38,35.56 143.38,69.85 E12.5 E14.10 134.49,81.28 R1.1 | E11.11 E11.10
  Bottom 0.406: E11.10 E11.5
RED_DELAY  (via drill 0.81)
  Top 0.406: E2.5 228.47,74.93 228.47,104.14 E3.9 | E3.2 223.39,111.76 v223.39,109.22
  Bottom 0.406: E3.9 224.66,107.95 | 224.66,107.95 v223.39,109.22 | TP1.TP 253.24,187.32 257.05,187.32 258.95,185.42 258.95,107.95 224.66,107.95
SET_DONE
  Top 0.406: E1.5 219.58,46.99 219.58,105.41 E3.6
STORE
  Bottom 0.406: E8.3 173.23,39.37 174.5,38.1 180.21,38.1 185.29,33.02 199.26,33.02 E5.9
TP3  (via drill 0.81)
  Top 0.406: v111.63,25.4 110.36,24.13 v110.36,15.24
  Bottom 0.406: E13.9 117.98,25.4 v111.63,25.4 | v110.36,15.24 109.73,15.24 109.09,14.61 109.09,8.26 OMNIBUS.CH2
VCC  (via drill 0.81)
  Top 0.813: E18.14 95.76,122.56 95.76,153.03 E19.14 98.93,158.75 C19.1 | E15.14 116.71,127 C15.1 | 10.67,113.03 R12.2 R5.2 R3.2 R2.2 R6.2 | 10.67,113.03 R13.2 | R11.2 10.67,95.89 10.67,113.03 | C25.1 41.78,88.9 41.78,86.36 E25.16 | E14.14 116.71,88.9 C14.1 | E4.14 224.66,157.48 C4.1 | R10.2 198.63,157.48 | 198.63,157.48 R9.2 R8.2 191.64,156.21 R21.2 | E3.14 224.66,120.65 C3.1 | E10.14 173.86,120.65 C10.1 | E7.14 199.26,120.65 C7.1 198.63,131.44 198.63,157.48 | C6.1 199.26,82.55 E6.14 197.99,78.74 197.99,57.15 C5.1 199.26,45.72 E5.14 198.63,42.55 198.63,25.4 v191.64,18.41 | R17.2 147.19,115.57 R16.2 R18.2 137.03,100.97 | R1.2 137.03,95.25 137.03,100.97 | C12.1 144.02,93.98 137.03,100.97 | v128.14,18.41 128.78,19.05 v128.78,21.59 v128.78,24.77 E13.8 135.13,40.01 v135.13,53.98 | E24.8 42.42,33.66 42.42,52.7 C24.1 | C16.1 v91.31,45.09 | R22.2 R15.2 253.87,34.29 R4.2 | E8.14 173.86,45.72 C8.1 173.86,64.77 E9.8 | E12.8 148.46,64.77 C11.1 | E1.16 237.36,46.99 C1.1 236.73,56.52 236.73,80.64 E2.16 237.36,83.82 C2.1
  Bottom 0.813: E23.14 70.99,158.75 67.18,158.75 65.91,160.02 65.91,164.47 | C23.1 65.91,164.47 | 65.91,164.47 89.41,164.47 C19.1 | 65.91,127 E22.14 | 65.91,127 C22.1 67.82,131.44 89.41,131.44 | 89.41,131.44 C18.1 | C15.1 114.81,131.44 97.03,131.44 | 89.41,131.44 97.03,131.44 | 39.24,127 38.61,127.64 38.61,129.54 C26.1 | 39.24,127 45.59,120.65 | 45.59,120.65 E26.14 | C28.1 R11.2 | R6.2 39.24,127 | 65.91,127 59.56,120.65 45.59,120.65 | E19.14 97.03,154.31 97.03,131.44 | E28.14 24.64,83.19 44.96,83.19 | E25.16 44.96,83.19 | 44.96,83.19 71.63,83.19 E21.14 75.44,83.19 100.84,83.19 | C21.1 67.82,93.34 89.41,93.34 C17.1 93.22,93.34 98.3,93.34 104.65,87 | 104.65,87 110.36,92.71 C14.1 | 104.65,87 100.84,83.19 | 100.84,83.19 E17.14 | E4.14 224.03,158.12 201.17,158.12 R10.2 | E7.14 198.63,121.28 177.04,121.28 E10.14 173.23,121.28 154.18,121.28 R16.2 | C3.1 222.76,128.91 201.17,128.91 C7.1 | R20.2 211.96,81.28 E6.14 | 171.96,95.89 C9.1 | 171.96,95.89 150.37,95.89 C12.1 | C6.1 197.36,95.89 171.96,95.89 | E14.14 135.13,92.08 135.13,92.71 R1.2 | E15.14 126.24,121.28 141.48,121.28 R17.2 | C31.+ v128.78,21.59 58.29,21.59 C32.+ | E11.8 145.29,24.77 v128.78,24.77 | v128.14,18.41 128.14,8.26 OMNIBUS.CA2 | E20.14 75.44,45.09 v91.31,45.09 97.03,45.09 E16.14 | 32.26,52.7 34.16,54.61 C24.1 | 32.26,52.7 24.64,45.09 | 24.64,45.09 E27.14 | 24.64,45.09 C27.1 | 32.26,52.7 64.01,52.7 C20.1 67.82,56.52 89.41,56.52 C16.1 93.22,56.52 118.62,56.52 120.52,54.61 C13.1 123.7,53.98 v135.13,53.98 146.56,53.98 | 253.87,24.77 253.87,22.86 C29.+ 260.86,22.86 260.86,8.26 OMNIBUS.AA2 | 253.87,24.77 R4.2 | C30.+ 250.06,22.86 251.97,24.77 253.87,24.77 | C11.1 146.56,53.98
  Bottom 0.813: C8.1 171.96,53.98 146.56,53.98 | C2.1 R19.2 | R7.2 204.34,40.64 E5.14 198.63,46.35 177.04,46.35 E8.14 | v191.64,18.41 191.64,8.26 OMNIBUS.BA2 | C1.1 235.46,57.78 201.17,57.78 C5.1 | R15.2 248.79,41.91 249.43,41.91 250.06,42.55 251.33,42.55 253.24,44.45 253.24,46.35 239.27,46.35 E1.16
WRITE_THRU
  Top 0.406: E10.9 177.67,104.14 177.67,41.91 E8.12
  Bottom 0.406: E8.12 180.21,39.37 185.29,34.29 E5.5
Z_PULSE
  Bottom 0.406: E27.12 16.38,31.75 8.76,31.75 8.13,31.11 6.86,31.11 6.22,31.75 R11.1 3.68,81.28 3.68,153.67 41.78,191.77 137.03,191.77 F.A2

## Text on the board
Top: FLIP CHIP | + | + | + | +
Bottom: SIDE 2 | VC8E CONTROL | M869D
tPlace: Warning: Autorouted version
200bmp: C:/Users/Vince/Documents/eagle/projects/DEC/Mxxx/M885/M869D-000.bmp